# Altium schematic sheet Power_micro_v3.SchDoc: Microcontroler and Power Supply Schematics
size A4; Date: 08/05/2016; Author: Francisco Jesús Lázaro Lorente
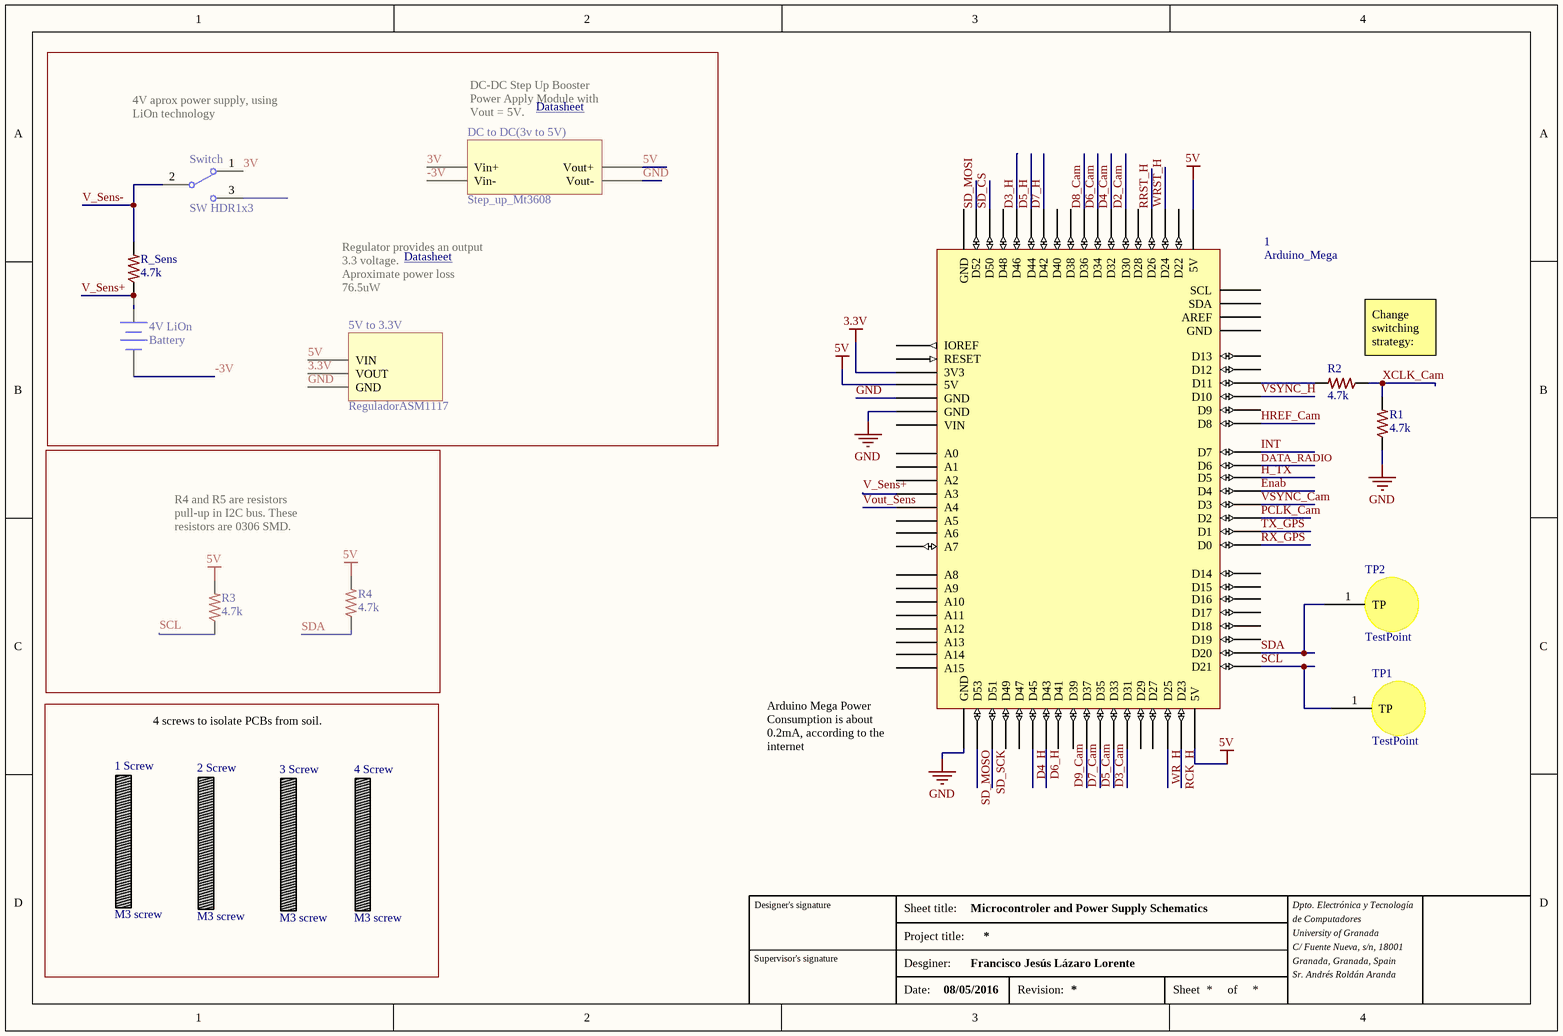
[diagram p0: Power_micro_v3.SchDoc]

## Parts
1  Arduino_Mega  [Footprint-ArduinoMega-headers - named]
1_Screw  M3 screw  [M3Screw]
2_Screw  M3 screw  [M3Screw]
3_Screw  M3 screw  [M3Screw]
4_Screw  M3 screw  [M3Screw]
4V_LiOn  Battery  [BAT-2 - duplicate]
5V_to_3.3V  ReguladorASM1117  [1X03 - ReguladorASM1117 - horizontal]
DC_to_DC(3v_to_5V)  Step_up_Mt3608  [Step_up_Mt3608]
R1  4.7k  [0805]
R2  4.7k  [0805]
R3  4.7k  [0805]
R4  4.7k  [0805]
R_Sens  4.7k  [0805]
Switch  SW HDR1x3  [SWITCH3x1]
TP1  TestPoint  [TestPoint]
TP2  TestPoint  [TestPoint]

## Nets
3.3V: 1.3V3 5V_to_3.3V.VOUT
5V: 1.5V_BB(5V) 1.5V_BT(5V) 1.5V_TL(5V) 5V_to_3.3V.VIN DC_to_DC(3v_to_5V).VOUT+(Vout+) R3.2 R4.2
GND: 1.GND_BB(GND) 1.GND_TLB(GND) 1.GND_TLT(GND) 5V_to_3.3V.GND DC_to_DC(3v_to_5V).VOUT-(Vout-) R1.1
3V: DC_to_DC(3v_to_5V).VIN+(Vin+) Switch.1(NC1)
-3V: 4V_LiOn.GND(-) DC_to_DC(3v_to_5V).VIN-(Vin-)
D2_Cam: 1.D30
D3_Cam: 1.D31
D3_H: 1.D46
D4_Cam: 1.D32
D4_H: 1.D45
D5_Cam: 1.D33
D5_H: 1.D44
D6_Cam: 1.D34
D6_H: 1.D43
D7_Cam: 1.D35
D7_H: 1.D42
D8_Cam: 1.D36
D9_Cam: 1.D37
DATA_RADIO: 1.D6
Enab: 1.D4
H_TX: 1.D5
HREF_Cam: 1.D8
INT: 1.D7
PCLK_Cam: 1.D2
RCK_H: 1.D23
RRST_H: 1.D26
RX_GPS: 1.D0
SCL: 1.D21 R3.1 TP1.1(TP)
SD_CS: 1.D50
SD_MOSI: 1.D52
SD_MOSO: 1.D53
SD_SCK: 1.D51
SDA: 1.D20 R4.1 TP2.1(TP)
TX_GPS: 1.D1
V_Sens+: 1.A3 4V_LiOn.VCC(+) R_Sens.1
V_Sens-: R_Sens.2 Switch.2(COMMON1)
Vout_Sens: 1.A4
VSYNC_Cam: 1.D3
VSYNC_H: 1.D10
WR_H: 1.D25
WRST_H: 1.D24
XCLK_Cam: R1.2 R2.1
Net1_D11: 1.D11 R2.2

Not connected (* = marked no-connect by the designer): 1 A0 A1 A2 A5 A6 A7 A8 A9 A10 A11 A12 A13 A14 A15 AREF D9 D12 D13 D14 D15 D16 D17 D18 D19 D22 D27 D28 D29 D38 D39 D40 D41 D47 D48 D49 GND_BT(GND) GND_TR(GND) IOREF RESET SCL SDA VIN; Switch 3(NO1)

## Notes on the sheet
- (near DC_to_DC(3v_to_5V)) DC-DC Step Up Booster Power Apply Module with Vout = 5V.
- (near DC_to_DC(3v_to_5V)) Datasheet <https://www.olimex.com/Products/Breadboarding/BB-PWR-3608/resources/MT3608.pdf>
- (near Switch) 4V aprox power supply, using LiOn technology
- Regulator provides an output  3.3 voltage.
  Aproximate power loss 76.5uW
- Datasheet <https://www.olimex.com/Products/Breadboarding/BB-PWR-3608/resources/MT3608.pdf>
- (near R2) Change switching strategy:
  - Diode
  - Transistor
- R4 and R5 are resistors pull-up in I2C bus. These resistors are 0306 SMD.
- 4 screws to isolate PCBs from soil.
- (near 1) Arduino Mega Power Consumption is about 0.2mA, according to the internet
- Designer's signature
- Sheet title:
- Dpto. Electrónica y Tecnología
- de Computadores
- Supervisor's signature
- Project title:
- Desginer:
- University of Granada
- C/ Fuente Nueva, s/n, 18001
- Granada, Granada, Spain
- Sr. Andrés Roldán Aranda
- Date:
- Revision:
- Sheet
- of

## Library data of the parts
4V_LiOn = Battery: Multicell Battery; Published: 24-Mar-1999; LatestRevisionDate: 17-Jul-2002; LatestRevisionNote: Re-released for DXP Platform.; PackageReference: BAT-2; Publisher: Altium Limited; PackageDescription: Battery; 2 Leads
R1-R4 R_Sens = 0805RESISTOR: Supplier 1: Digi-Key